# EAGLE schematic board (EAGLE 9.6.2)

## Sheet 1 of 4: MCU and Motors
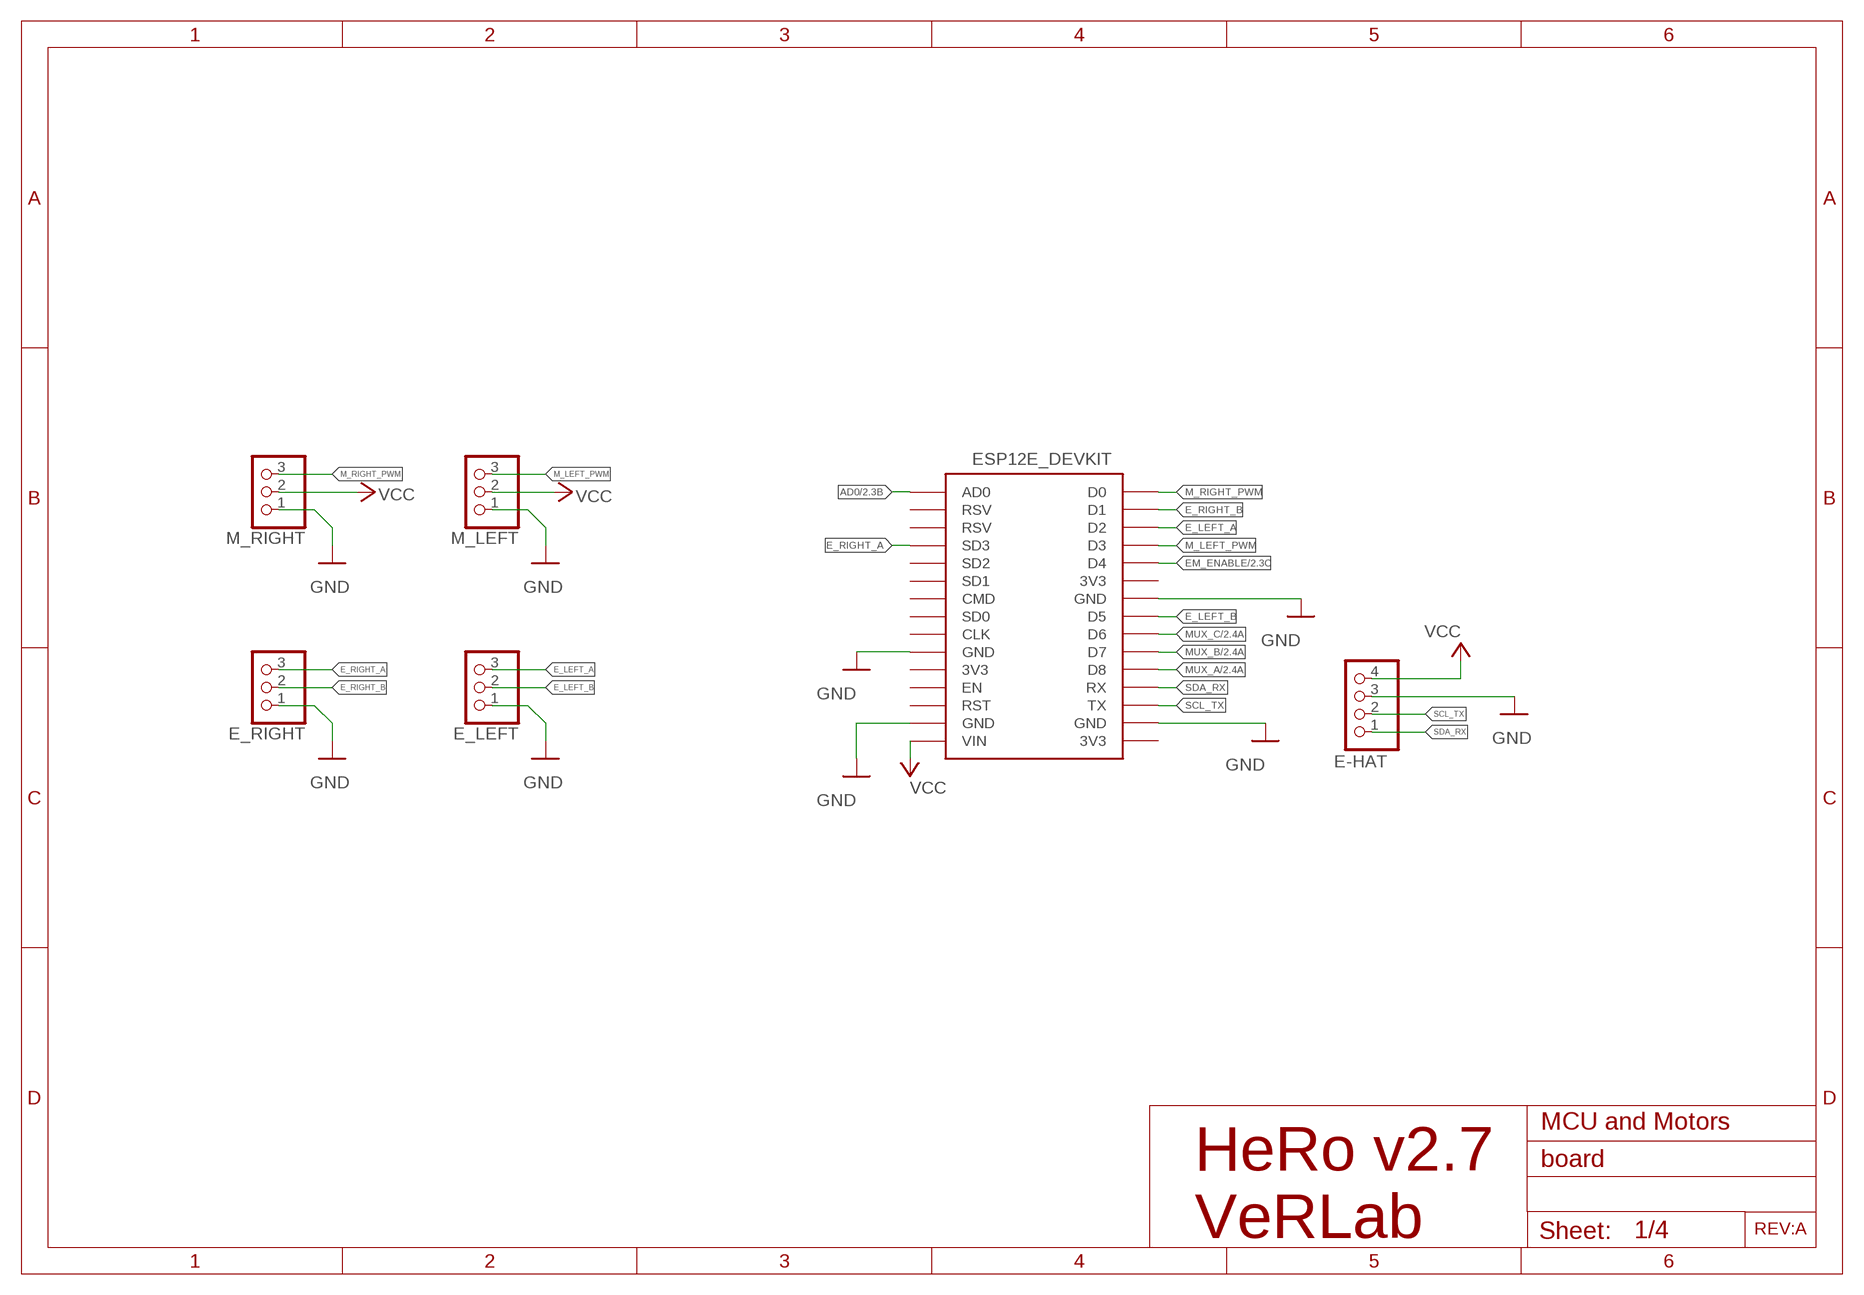
[diagram p0: schematic, sheet 1]
FRAME2 (A4L-LOC): TITLE: MCU and Motors

### Parts
E-HAT  PINHD-1X4  [1X04]
E_LEFT  PINHD-1X3  [1X03]
E_RIGHT  PINHD-1X3  [1X03]
ESP-12E  ESP12E_DEVKIT  [ESP12E_DEVKIT]
M_LEFT  PINHD-1X3  [1X03]
M_RIGHT  PINHD-1X3  [1X03]

### Nets
AD0: ESP-12E.AD0 ; also sheet 2
E_LEFT_A: E_LEFT.3 ESP-12E.D2
E_LEFT_B: E_LEFT.2 ESP-12E.D5
E_RIGHT_A: E_RIGHT.3 ESP-12E.SD3
E_RIGHT_B: E_RIGHT.2 ESP-12E.D1
EM_ENABLE: ESP-12E.D4 ; also sheet 2,3
GND: E-HAT.3 E_LEFT.1 E_RIGHT.1 ESP-12E.GND@0(GND) ESP-12E.GND@1(GND) ESP-12E.GND@2(GND) ESP-12E.GND@3(GND) M_LEFT.1 M_RIGHT.1 ; also sheet 2,3,4
M_LEFT_PWM: ESP-12E.D3 M_LEFT.3
M_RIGHT_PWM: ESP-12E.D0 M_RIGHT.3
MUX_A: ESP-12E.D8 ; also sheet 2
MUX_B: ESP-12E.D7 ; also sheet 2
MUX_C: ESP-12E.D6 ; also sheet 2
SCL_TX: E-HAT.2 ESP-12E.TX
SDA_RX: E-HAT.1 ESP-12E.RX
VCC: E-HAT.4 ESP-12E.VIN M_LEFT.2 M_RIGHT.2 ; also sheet 2,3,4
Unconnected: ESP-12E.3V3@0(3V3) ESP-12E.3V3@1(3V3) ESP-12E.3V3@2(3V3) ESP-12E.CLK ESP-12E.CMD ESP-12E.EN ESP-12E.RST ESP-12E.RSV@0(RSV) ESP-12E.RSV@1(RSV) ESP-12E.SD0 ESP-12E.SD1 ESP-12E.SD2

### Notes on the sheet
- REV:A
- HeRo v2.7
  VeRLab

## Sheet 2 of 4: Proximity Sensors
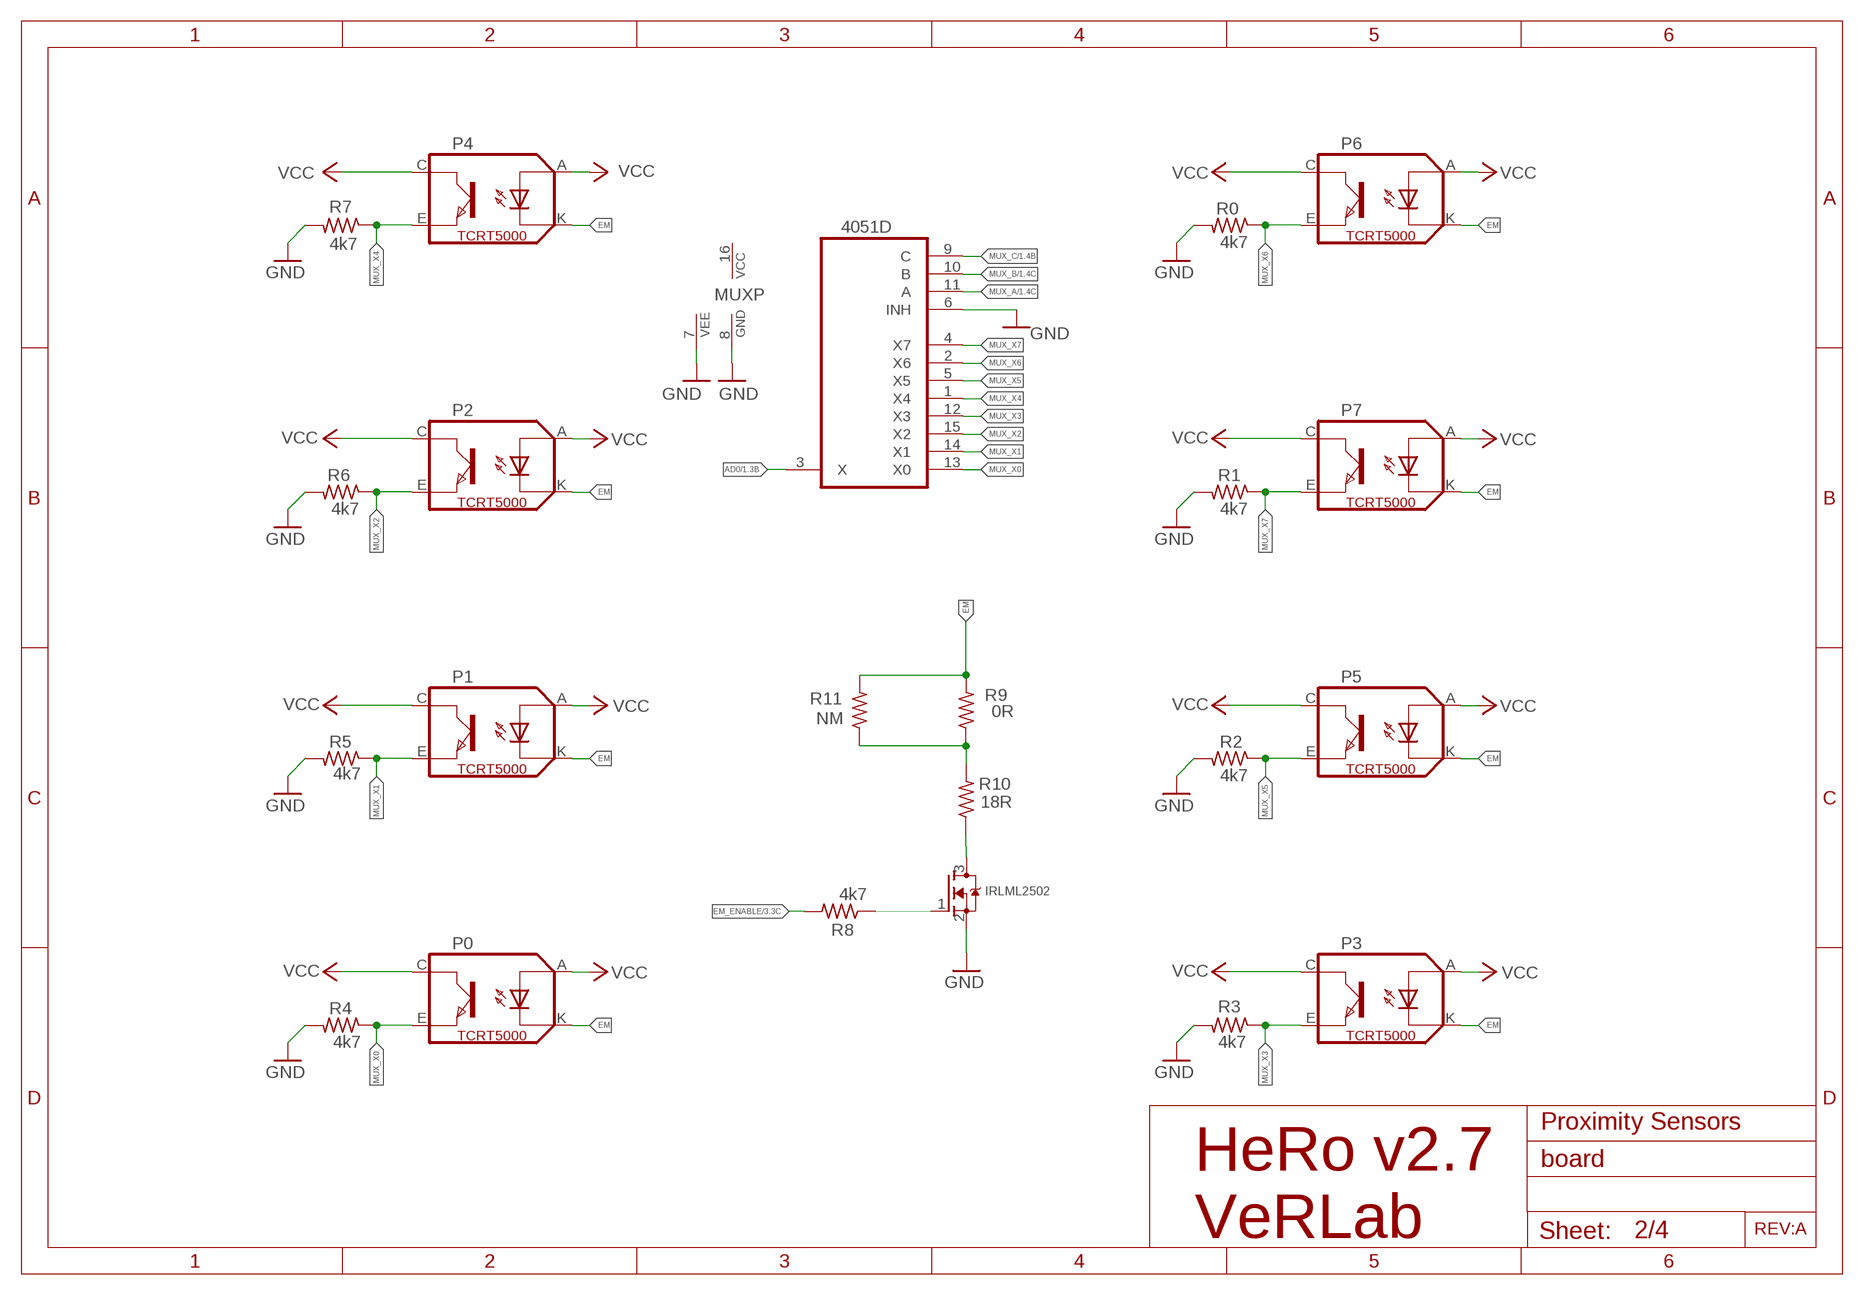
[diagram p1: schematic, sheet 2]
FRAME1 (A4L-LOC): TITLE: Proximity Sensors

### Parts
IRLML2502  MOSFET-NREFLOW  [SOT23]
MUX  4051D  [SO16]
P0  TCRT5000  [TCRT5000]
P1  TCRT5000  [TCRT5000]
P2  TCRT5000  [TCRT5000]
P3  TCRT5000  [TCRT5000]
P4  TCRT5000  [TCRT5000]
P5  TCRT5000  [TCRT5000]
P6  TCRT5000  [TCRT5000]
P7  TCRT5000  [TCRT5000]
R0  4k7  R-US_M0805  [M0805]
R1  4k7  R-US_M0805  [M0805]
R2  4k7  R-US_M0805  [M0805]
R3  4k7  R-US_M0805  [M0805]
R4  4k7  R-US_M0805  [M0805]
R5  4k7  R-US_M0805  [M0805]
R6  4k7  R-US_M0805  [M0805]
R7  4k7  R-US_M0805  [M0805]
R8  4k7  R-US_R0805  [R0805]
R9  0R  R-US_R0805  [R0805]
R10  18R  R-US_R0805  [R0805]
R11  NM  R-US_R0805  [R0805]

### Nets
AD0: MUX.3(X) ; also sheet 1
EM: P0.K(CATHODE) P1.K(CATHODE) P2.K(CATHODE) P3.K(CATHODE) P4.K(CATHODE) P5.K(CATHODE) P6.K(CATHODE) P7.K(CATHODE) R9.2 R11.2
EM_ENABLE: R8.2 ; also sheet 1,3
GND: IRLML2502.2(S) MUX.6(INH) MUX.7(VEE) MUX.8(GND) R0.2 R1.2 R2.2 R3.2 R4.2 R5.2 R6.2 R7.2 ; also sheet 1,3,4
MUX_A: MUX.11(A) ; also sheet 1
MUX_B: MUX.10(B) ; also sheet 1
MUX_C: MUX.9(C) ; also sheet 1
MUX_X0: MUX.13(X0) P0.E(EMITTER) R4.1
MUX_X1: MUX.14(X1) P1.E(EMITTER) R5.1
MUX_X2: MUX.15(X2) P2.E(EMITTER) R6.1
MUX_X3: MUX.12(X3) P3.E(EMITTER) R3.1
MUX_X4: MUX.1(X4) P4.E(EMITTER) R7.1
MUX_X5: MUX.5(X5) P5.E(EMITTER) R2.1
MUX_X6: MUX.2(X6) P6.E(EMITTER) R0.1
MUX_X7: MUX.4(X7) P7.E(EMITTER) R1.1
N$3: IRLML2502.3(D) R10.1
N$4: R9.1 R10.2 R11.1
N$6: IRLML2502.1(G) R8.1
VCC: P0.A(ANODE) P0.C(COLLECTOR) P1.A(ANODE) P1.C(COLLECTOR) P2.A(ANODE) P2.C(COLLECTOR) P3.A(ANODE) P3.C(COLLECTOR) P4.A(ANODE) P4.C(COLLECTOR) P5.A(ANODE) P5.C(COLLECTOR) P6.A(ANODE) P6.C(COLLECTOR) P7.A(ANODE) P7.C(COLLECTOR) ; also sheet 1,3,4

### Notes on the sheet
- REV:A
- HeRo v2.7
  VeRLab

## Sheet 3 of 4: LED RGB
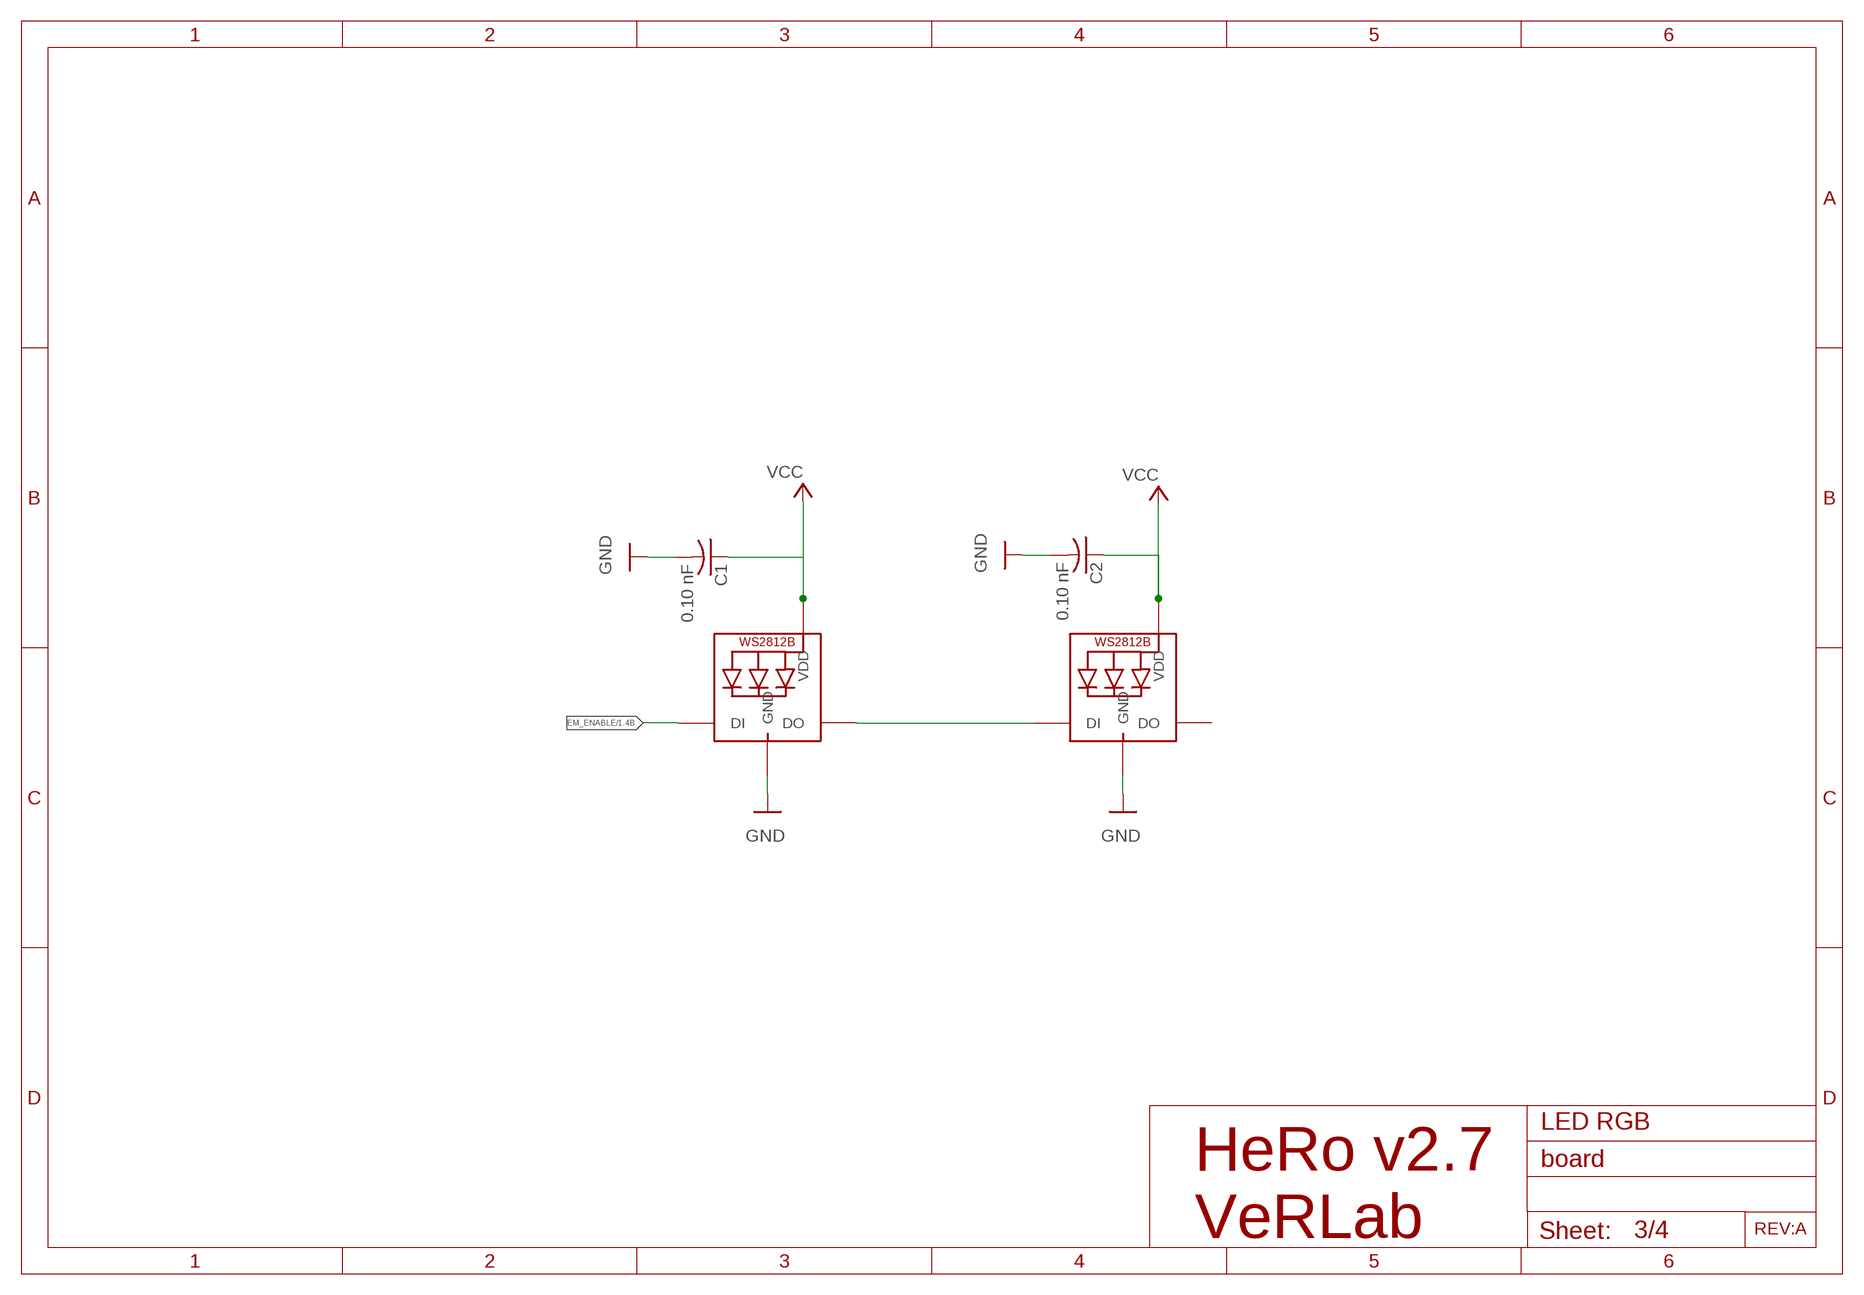
[diagram p2: schematic, sheet 3]
FRAME3 (A4L-LOC): TITLE: LED RGB

### Parts
C1  0.10 nF  C-USC0603  [C0603]
C2  0.10 nF  C-USC0603  [C0603]
LED0  WS2812B5050  [WS2812B]
LED1  WS2812B5050  [WS2812B]

### Nets
EM_ENABLE: LED0.4-DIN(DI) ; also sheet 1,2
GND: C1.2 C2.2 LED0.3-GND(GND) LED1.3-GND(GND) ; also sheet 1,2,4
VCC: C1.1 C2.1 LED0.1-VDD(VDD) LED1.1-VDD(VDD) ; also sheet 1,2,4
WS_OUT: LED0.2-DOUT(DO) LED1.4-DIN(DI)
Unconnected: LED1.2-DOUT(DO)

### Notes on the sheet
- REV:A
- HeRo v2.7
  VeRLab

## Sheet 4 of 4: Power Supply
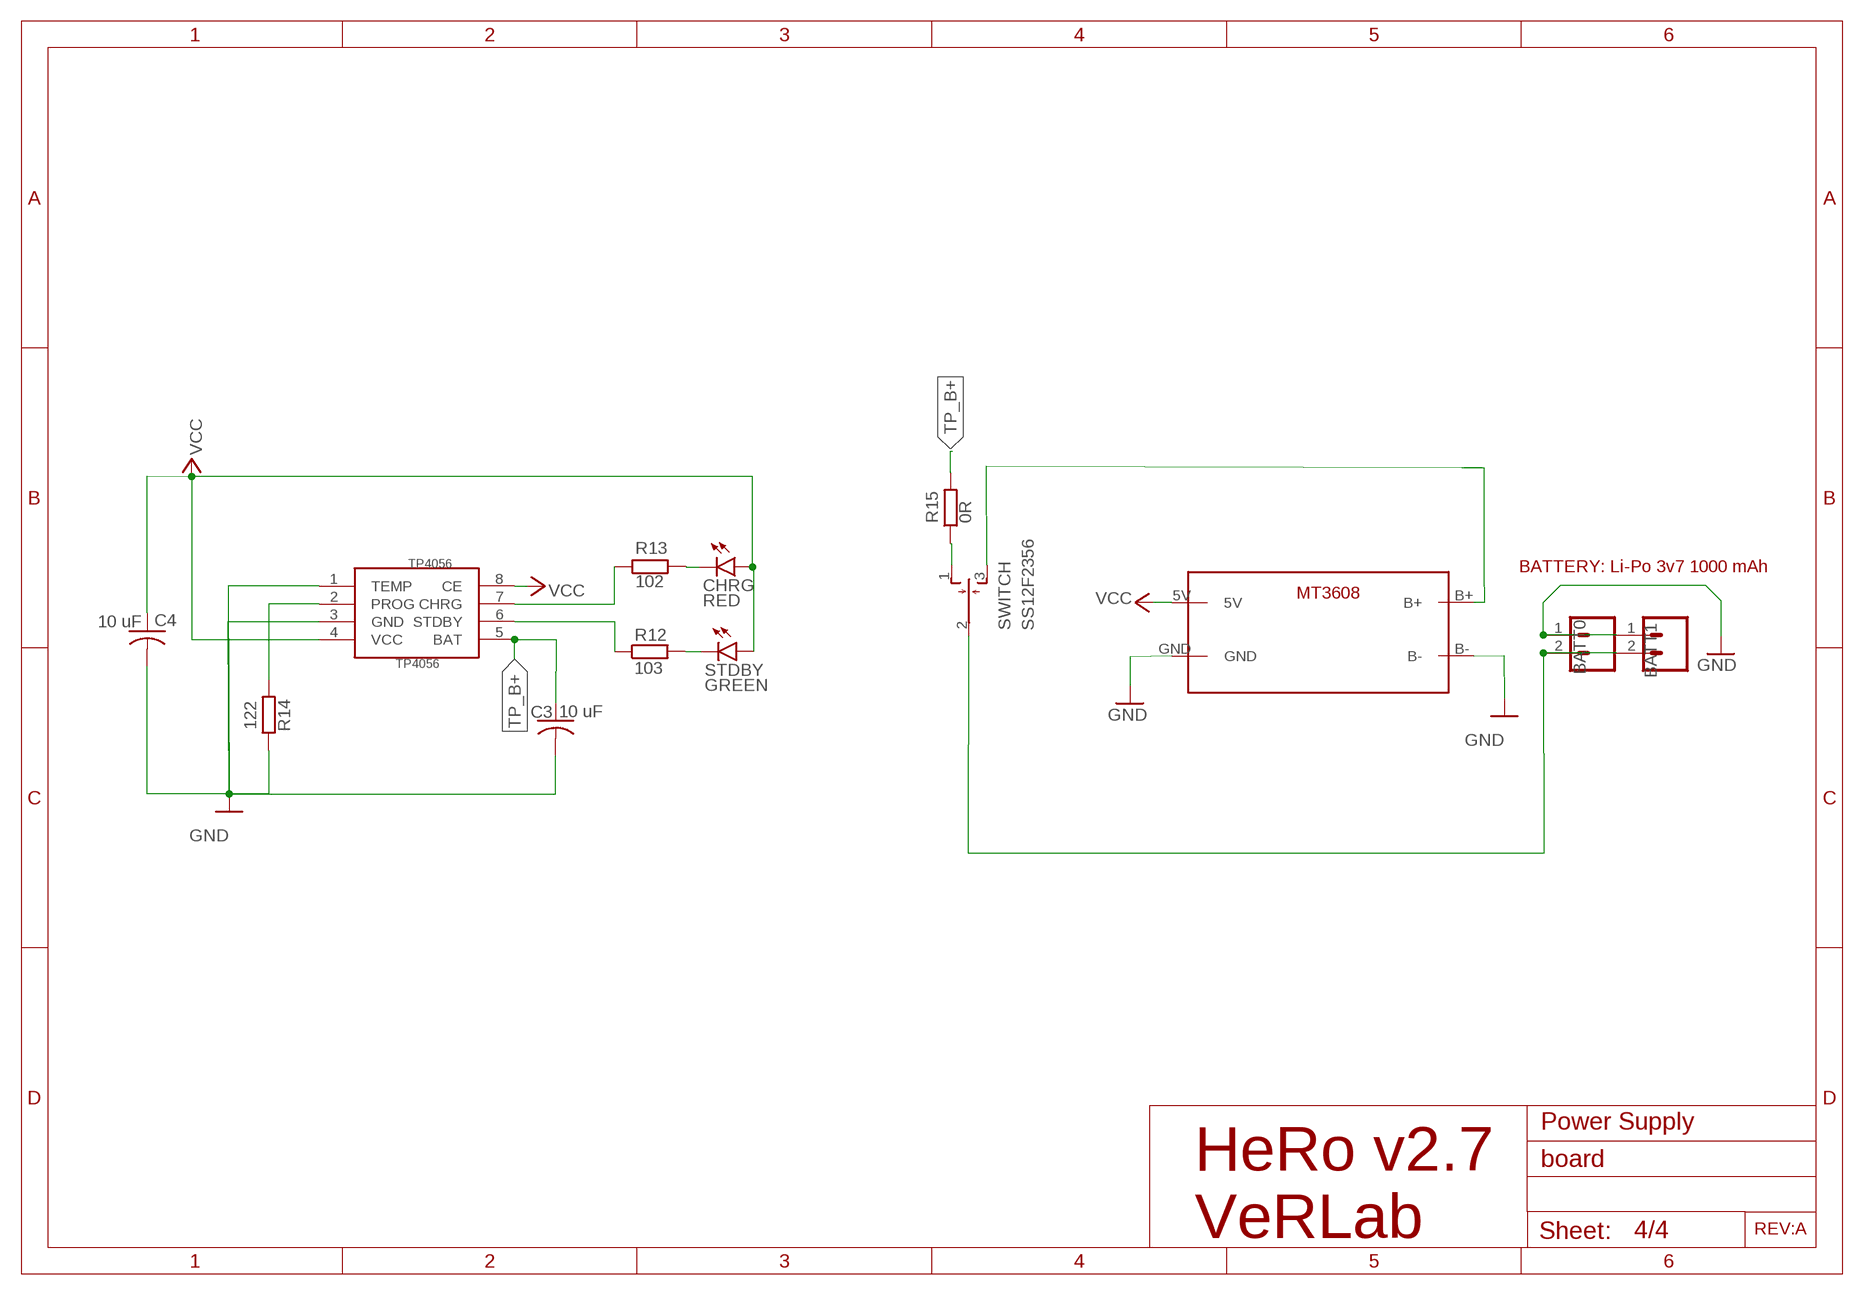
[diagram p3: schematic, sheet 4]
FRAME4 (A4L-LOC): TITLE: Power Supply

### Parts
BATT0  CONN_02JST-PTH-2  [JST-2-PTH]
BATT1  CONN_02JST-PTH-2  [JST-2-PTH]
C3  10 uF  C-USC0603  [C0603]
C4  10 uF  C-USC0603  [C0603]
CHRG  RED  LEDSML0805  [SML0805]
MT3608  MT3608  [MT3608]
R12  103  R-EU_R0805  [R0805]
R13  102  R-EU_R0805  [R0805]
R14  122  R-EU_R0603  [R0603]
R15  0R  R-EU_R0805  [R0805]
STDBY  GREEN  LEDSML0805  [SML0805]
SWITCH  SS12F2356  [HH3T90]
TP4056  TP4056  [SOP-8]

### Nets
B+: MT3608.B+ SWITCH.3(S)
CHRG: R13.1 TP4056.7(CHRG)
GND: BATT0.1 BATT1.1 C3.2 C4.2 MT3608.B- MT3608.GND R14.1 TP4056.1(TEMP) TP4056.3(GND) ; also sheet 1,2,3
N$2: BATT0.2 BATT1.2 SWITCH.2(P)
N$5: CHRG.C R13.2
N$8: R12.2 STDBY.C
PROG: R14.2 TP4056.2(PROG)
STDBY: R12.1 TP4056.6(STDBY)
TP_B+: C3.1 R15.2 TP4056.5(BAT)
TP_BS: R15.1 SWITCH.1(O)
VCC: C4.1 CHRG.A MT3608.5V STDBY.A TP4056.4(VCC) TP4056.8(CE) ; also sheet 1,2,3

### Notes on the sheet
- BATTERY: Li-Po 3v7 1000 mAh
- REV:A
- HeRo v2.7
  VeRLab

## Power pins joined to a net without a drawn wire
VCC: MUX.16(VCC)

## Library data of the parts
BATT0 BATT1 = SparkFun-Connectors:CONN_02: Multi connection point. Often used as Generic Header-pin footprint for 0.1 inch spaced/style header connections On any of the 0.1 inch spaced packages, you can populate with these: Break Away Headers - Straight <https://www.sparkfun.com/products/116> (PRT-00116) Break Away Male Headers - Right Angle <https://www.sparkfun.com/products/553> (PRT-00553) Female Headers <https://www.sparkfun.com/products/115> (PRT-00115) Break Away Headers - Machine Pin <https://www.sparkfun.com/products/117> (PRT-00117) Break Away Female Headers - Swiss Machine Pin <https://www.sparkfun.com/products/743> (PRT-00743) For SCREWTERMINALS and SPRING TERMINALS visit here: Screw Terimnals on SparkFun.com <https://www.sparkfun.com/search/results?term=Screw+Terminals> (5mm/3.5mm/2.54mm spacing) This device is also useful as a general connection point to wire up your design to another part of your project. Our various solder wires solder well into these plated through hole pads. Hook-Up Wire - Assortment (Stranded, 22 AWG) <https://www.sparkfun.com/products/11375> (PRT-11375) Hook-Up Wire - Assortment (Solid Core, 22 AWG) <https://www.sparkfun.com/products/11367> (PRT-11367) View the entire wire category on our website here <https://www.sparkfun.com/categories/141> Special notes: Molex polarized connector foot print use with: PRT-08233 with associated crimp pins and housings. 2.54_SCREWTERM for use with PRT-10571. 3.5mm Screw Terminal footprints for PRT-08084 5mm Screw Terminal footprints for use with PRT-08432; PROD_ID: CONN-09863; SKU: PRT-09914
C1 C2 = adafruit:C-US: CAPACITOR, American symbol
C3 C4 = resistor:C-US: CAPACITOR, American symbol
CHRG STDBY = led:LED: LED OSRAM: - CHIPLED LG R971, LG N971, LY N971, LG Q971, LY Q971, LO R971, LY R971 LH N974, LH R974 LS Q976, LO Q976, LY Q976 LO Q996 - Hyper CHIPLED LW Q18S LB Q993, LB Q99A, LB R99A - SideLED LS A670, LO A670, LY A670, LG A670, LP A670 LB A673, LV A673, LT A673, LW A673 LH A674 LY A675 LS A676, LA A676, LO A676, LY A676, LW A676 LS A679, LY A679, LG A679 - Hyper Micro SIDELED® LS Y876, LA Y876, LO Y876, LY Y876 LT Y87S - SmartLED LW L88C, LW L88S LB L89C, LB L89S, LG L890 LS L89K, LO L89K, LY L89K LS L896, LA L896, LO L896, LY L896 - TOPLED LS T670, LO T670, LY T670, LG T670, LP T670 LSG T670, LSP T670, LSY T670, LOP T670, LYG T670 LG T671, LOG T671, LSG T671 LB T673, LV T673, LT T673, LW T673 LH T674 LS T676, LA T676, LO T676, LY T676, LB T676, LH T676, LSB T676, LW T676 LB T67C, LV T67C, LT T67C, LS T67K, LO T67K, LY T67K, LW E67C LS E67B, LA E67B, LO E67B, LY E67B, LB E67C, LV E67C, LT E67C LW T67C LS T679, LY T679, LG T679 LS T770, LO T770, LY T770, LG T770, LP T770 LB T773, LV T773, LT T773, LW T773 LH T774 LS E675, LA E675, LY E675, LS T675 LS T776, LA T776, LO T776, LY T776, LB T776 LHGB T686 LT T68C, LB T68C - Hyper Mini TOPLED® LB M676 - Mini TOPLED Santana® LG M470 LS M47K, LO M47K, LY M47K Source: http://www.osram.convergy.de LUXEON: - LUMILED® LXK2-PW12-R00, LXK2-PW12-S00, LXK2-PW14-U00, LXK2-PW14-V00 LXK2-PM12-R00, LXK2-PM12-S00, LXK2-PM14-U00 LXK2-PE12-Q00, LXK2-PE12-R00, LXK2-PE12-S00, LXK2-PE14-T00, LXK2-PE14-U00 LXK2-PB12-K00, LXK2-PB12-L00, LXK2-PB12-M00, LXK2-PB14-N00, LXK2-PB14-P00, LXK2-PB14-Q00 LXK2-PR12-L00, LXK2-PR12-M00, LXK2-PR14-Q00, LXK2-PR14-R00 LXK2-PD12-Q00, LXK2-PD12-R00, LXK2-PD12-S00 LXK2-PH12-R00, LXK2-PH12-S00 LXK2-PL12-P00, LXK2-PL12-Q00, LXK2-PL12-R00 Source: www.luxeon.com KINGBRIGHT: KA-3528ASYC Source: www.kingbright.com
E-HAT = pinhead:PINHD-1X4: PIN HEADER
E_LEFT E_RIGHT M_LEFT M_RIGHT = pinhead:PINHD-1X3: PIN HEADER
ESP-12E = ESP12E_DEVKIT:ESP12E_DEVKIT: ESP12E DEVKIT BOARD
IRLML2502 = adafruit:MOSFET-N: N-Channel Mosfet 2N7002E - 60V 260mA SOT23 [Digikey: 2N7002ET1GOSTR-ND] - REEL BSH103 - 30V 850mA SOT23 [Digikey: 568-5013-1-ND]
LED0 LED1 = adafruit:WS2812B
MT3608 = stepup:MT3608: Stepup
MUX = 40xx:4051: 8-channel ANALOG MULTIPLEXER
P0 P1-P7 = tcrt5000:TCRT5000
R0 R1-R7 = adafruit:R-US_: RESISTOR, American symbol
R8-R11 = resistor:R-US_: RESISTOR, American symbol; SPICEPREFIX: R
R12-R15 = resistor:R-EU_: RESISTOR, European symbol
SWITCH = switch:SS12F2356: TINY SWITCH MOM OFF MOM Source: http://www2.produktinfo.conrad.com/datenblaetter/700000-724999/705152-da-01-de-Subminiaturschalter_TL_36YO.pdf
TP4056 = TP4056:TP4056; SPICEPREFIX: X

## Net classes
0 default: width 0.508 mm, drill 0.508 mm, clearance 0.203 mm
1 gnd: width 0.508 mm, drill 0.508 mm, clearance 0.203 mm